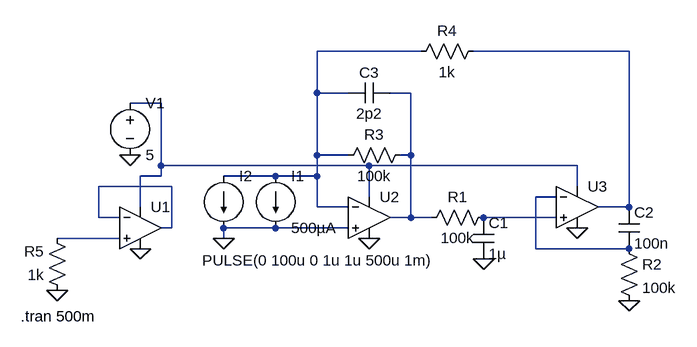
[diagram p0: schematic Photodiode.asc]
Photodiode.asc, the LTspice schematic file:
Version 4
SHEET 1 880 680
WIRE 240 -80 80 -80
WIRE 560 -80 320 -80
WIRE 80 -16 80 -80
WIRE 128 -16 80 -16
WIRE 224 -16 192 -16
WIRE -160 0 -208 0
WIRE 80 80 80 -16
WIRE 128 80 80 80
WIRE 224 80 224 -16
WIRE 224 80 208 80
WIRE -160 96 -160 0
WIRE 160 96 -160 96
WIRE 480 96 160 96
WIRE -160 112 -160 96
WIRE -160 112 -192 112
WIRE 16 112 -64 112
WIRE 80 112 80 80
WIRE 80 112 16 112
WIRE -144 128 -256 128
WIRE 480 128 480 96
WIRE 160 144 160 96
WIRE 448 144 416 144
WIRE -192 160 -192 112
WIRE 80 160 80 112
WIRE 128 160 80 160
WIRE 560 160 560 -80
WIRE 560 160 512 160
WIRE -256 176 -256 128
WIRE -224 176 -256 176
WIRE 224 176 224 80
WIRE 224 176 192 176
WIRE 256 176 224 176
WIRE 448 176 336 176
WIRE -144 192 -144 128
WIRE -144 192 -160 192
WIRE 16 192 -64 192
WIRE 128 192 16 192
WIRE -224 208 -320 208
WIRE -64 208 -64 192
WIRE 416 224 416 144
WIRE 560 224 416 224
FLAG -320 288 0
FLAG 336 240 0
FLAG 560 304 0
FLAG 480 192 0
FLAG 160 208 0
FLAG -192 224 0
FLAG -208 80 0
FLAG -64 208 0
SYMBOL cap 320 176 R0
SYMATTR InstName C1
SYMATTR Value 1µ
SYMBOL res 240 192 R270
WINDOW 0 32 56 VTop 2
WINDOW 3 0 56 VBottom 2
SYMATTR InstName R1
SYMATTR Value 100k
SYMBOL cap 544 160 R0
SYMATTR InstName C2
SYMATTR Value 100n
SYMBOL res 544 208 R0
SYMATTR InstName R2
SYMATTR Value 100k
SYMBOL cap 128 0 R270
WINDOW 0 32 32 VTop 2
WINDOW 3 0 32 VBottom 2
SYMATTR InstName C3
SYMATTR Value 2p2
SYMBOL res 112 96 R270
WINDOW 0 32 56 VTop 2
WINDOW 3 0 56 VBottom 2
SYMATTR InstName R3
SYMATTR Value 100k
SYMBOL res 224 -64 R270
WINDOW 0 32 56 VTop 2
WINDOW 3 0 56 VBottom 2
SYMATTR InstName R4
SYMATTR Value 1k
SYMBOL res -304 304 R180
WINDOW 0 36 76 Left 2
WINDOW 3 36 40 Left 2
SYMATTR InstName R5
SYMATTR Value 1k
SYMBOL voltage -208 -16 R0
WINDOW 123 0 0 Left 2
WINDOW 39 0 0 Left 2
SYMATTR InstName V1
SYMATTR Value 5
SYMBOL current 16 112 R0
WINDOW 123 0 0 Left 2
WINDOW 39 0 0 Left 2
SYMATTR InstName I1
SYMATTR Value 500µA
SYMBOL current -64 112 R0
WINDOW 3 -33 130 Left 2
WINDOW 123 0 0 Left 2
WINDOW 39 0 0 Left 2
SYMATTR Value PULSE(0 100u 0 1u 1u 500u 1m)
SYMATTR InstName I2
SYMBOL Opamps\\UniversalOpamp2 -192 192 R0
SYMATTR InstName U1
SYMBOL Opamps\\UniversalOpamp2 160 176 R0
SYMATTR InstName U2
SYMBOL Opamps\\UniversalOpamp2 480 160 R0
SYMATTR InstName U3
TEXT -376 328 Left 2 !.tran 500m

The netlist it stands for:
* Photodiode.asc
C1 N007 0 1µ
R1 N003 N007 100k
C2 N002 N006 100n
R2 N006 0 100k
C3 N001 N003 2p2
R3 N001 N003 100k
R4 N001 N002 1k
R5 0 N008 1k
V1 N004 0 5
I1 N001 0 500µA
I2 N001 0 PULSE(0 100u 0 1u 1u 500u 1m)
XU1 N008 N005 N004 0 N005 level.2 Avol=1Meg GBW=10Meg Slew=10Meg ilimit=25m rail=0 Vos=0 phimargin=45 en=0 enk=0 in=0 ink=0 Rin=500Meg  ; pins IN+ IN- V+ V- OUT
XU2 0 N001 N004 0 N003 level.2 Avol=1Meg GBW=10Meg Slew=10Meg ilimit=25m rail=0 Vos=0 phimargin=45 en=0 enk=0 in=0 ink=0 Rin=500Meg  ; pins IN+ IN- V+ V- OUT
XU3 N007 N006 N004 0 N002 level.2 Avol=1Meg GBW=10Meg Slew=10Meg ilimit=25m rail=0 Vos=0 phimargin=45 en=0 enk=0 in=0 ink=0 Rin=500Meg  ; pins IN+ IN- V+ V- OUT
.tran 500m
.lib UniversalOpamps2.sub
.backanno
.end